# EAGLE design lithium-left-c (EAGLE 9.6.2)

## Sheet 1 of 2
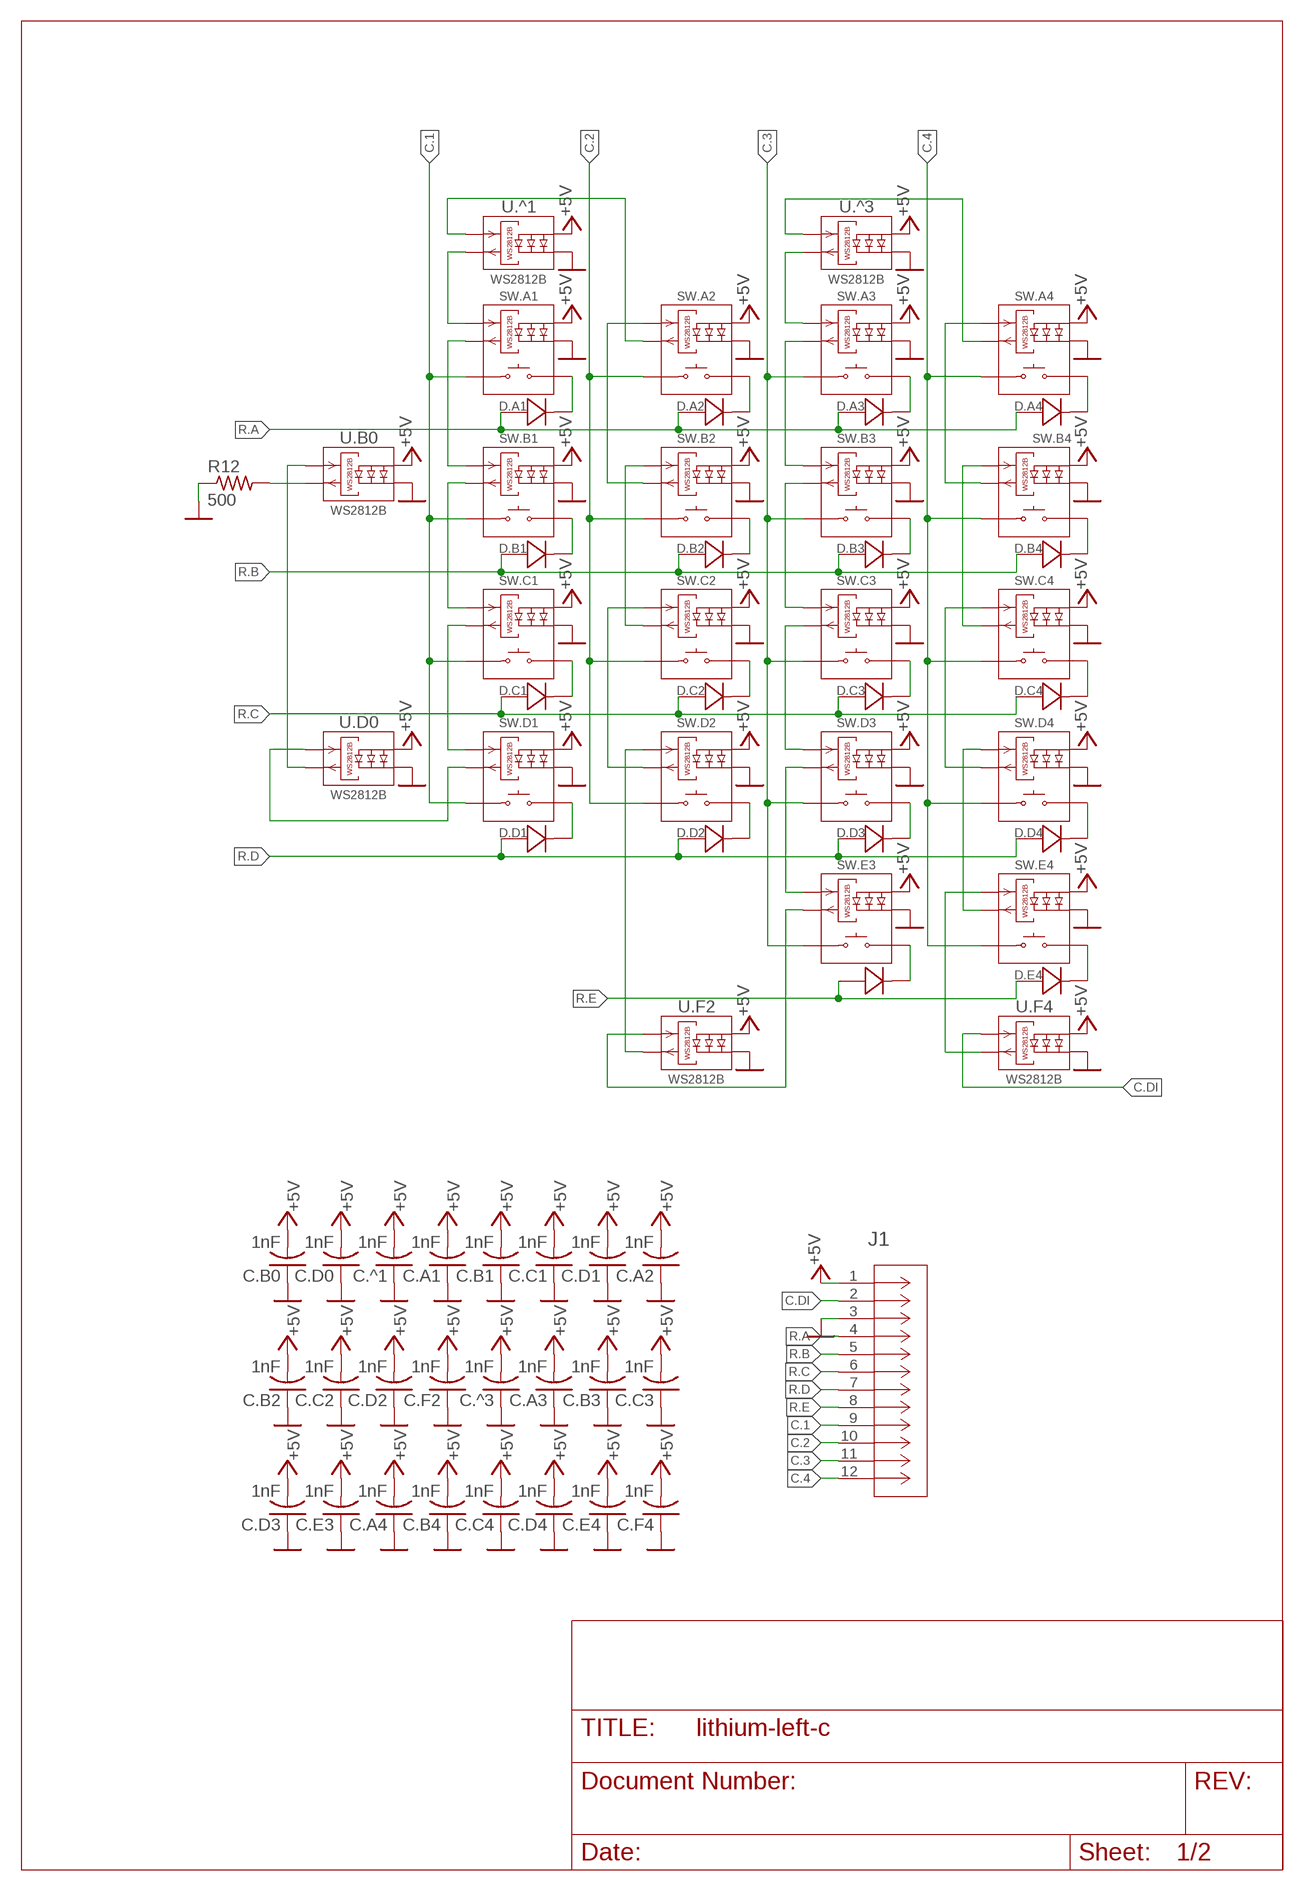
[diagram p0: schematic, sheet 1]

### Parts
C.^1  1nF  C-USC0805  [C0805]
C.^3  1nF  C-USC0805  [C0805]
C.A1  1nF  C-USC0805  [C0805]
C.A2  1nF  C-USC0805  [C0805]
C.A3  1nF  C-USC0805  [C0805]
C.A4  1nF  C-USC0805  [C0805]
C.B0  1nF  C-USC0805  [C0805]
C.B1  1nF  C-USC0805  [C0805]
C.B2  1nF  C-USC0805  [C0805]
C.B3  1nF  C-USC0805  [C0805]
C.B4  1nF  C-USC0805  [C0805]
C.C1  1nF  C-USC0805  [C0805]
C.C2  1nF  C-USC0805  [C0805]
C.C3  1nF  C-USC0805  [C0805]
C.C4  1nF  C-USC0805  [C0805]
C.D0  1nF  C-USC0805  [C0805]
C.D1  1nF  C-USC0805  [C0805]
C.D2  1nF  C-USC0805  [C0805]
C.D3  1nF  C-USC0805  [C0805]
C.D4  1nF  C-USC0805  [C0805]
C.E3  1nF  C-USC0805  [C0805]
C.E4  1nF  C-USC0805  [C0805]
C.F2  1nF  C-USC0805  [C0805]
C.F4  1nF  C-USC0805  [C0805]
D.A1  1N4148W  [CR_48W-E3-08_VIS]
D.A2  1N4148W  [CR_48W-E3-08_VIS]
D.A3  1N4148W  [CR_48W-E3-08_VIS]
D.A4  1N4148W  [CR_48W-E3-08_VIS]
D.B1  1N4148W  [CR_48W-E3-08_VIS]
D.B2  1N4148W  [CR_48W-E3-08_VIS]
D.B3  1N4148W  [CR_48W-E3-08_VIS]
D.B4  1N4148W  [CR_48W-E3-08_VIS]
D.C1  1N4148W  [CR_48W-E3-08_VIS]
D.C2  1N4148W  [CR_48W-E3-08_VIS]
D.C3  1N4148W  [CR_48W-E3-08_VIS]
D.C4  1N4148W  [CR_48W-E3-08_VIS]
D.D1  1N4148W  [CR_48W-E3-08_VIS]
D.D2  1N4148W  [CR_48W-E3-08_VIS]
D.D3  1N4148W  [CR_48W-E3-08_VIS]
D.D4  1N4148W  [CR_48W-E3-08_VIS]
D.E3  1N4148W  [CR_48W-E3-08_VIS]
D.E4  1N4148W  [CR_48W-E3-08_VIS]
J1  FFC2B28-12-G  [CONN_FFC2B28-12-G_GCT]
R12  500  R-US_R0805  [R0805]
SW.A1  PG1350_LEDSD  [PG1350_SD/SK68]
SW.A2  PG1350_LEDSD  [PG1350_SD/SK68]
SW.A3  PG1350_LEDSD  [PG1350_SD/SK68]
SW.A4  PG1350_LEDSD  [PG1350_SD/SK68]
SW.B1  PG1350_LEDSD  [PG1350_SD/SK68]
SW.B2  PG1350_LEDSD  [PG1350_SD/SK68]
SW.B3  PG1350_LEDSD  [PG1350_SD/SK68]
SW.B4  PG1350_LEDSD  [PG1350_SD/SK68]
SW.C1  PG1350_LEDSD  [PG1350_SD/SK68]
SW.C2  PG1350_LEDSD  [PG1350_SD/SK68]
SW.C3  PG1350_LEDSD  [PG1350_SD/SK68]
SW.C4  PG1350_LEDSD  [PG1350_SD/SK68]
SW.D1  PG1350_LEDSD  [PG1350_SD/SK68]
SW.D2  PG1350_LEDSD  [PG1350_SD/SK68]
SW.D3  PG1350_LEDSD  [PG1350_SD/SK68]
SW.D4  PG1350_LEDSD  [PG1350_SD/SK68]
SW.E3  PG1350_LEDSD  [PG1350_SD/SK68]
SW.E4  PG1350_LEDSD  [PG1350_SD/SK68]
U.^1  WS2812B  [SK68-R]
U.^3  WS2812B  [SK68-R]
U.B0  WS2812B  [SK68-R]
U.D0  WS2812B  [SK68-R]
U.F2  WS2812B  [SK68-R]
U.F4  WS2812B  [SK68-R]

### Nets
+5V [VCC]: C.^1.2 C.^3.2 C.A1.2 C.A2.2 C.A3.2 C.A4.2 C.B0.2 C.B1.2 C.B2.2 C.B3.2 C.B4.2 C.C1.2 C.C2.2 C.C3.2 C.C4.2 C.D0.2 C.D1.2 C.D2.2 C.D3.2 C.D4.2 C.E3.2 C.E4.2 C.F2.2 C.F4.2 J1.1 SW.A1.1-VDD(VDD) SW.A2.1-VDD(VDD) SW.A3.1-VDD(VDD) SW.A4.1-VDD(VDD) SW.B1.1-VDD(VDD) SW.B2.1-VDD(VDD) SW.B3.1-VDD(VDD) SW.B4.1-VDD(VDD) SW.C1.1-VDD(VDD) SW.C2.1-VDD(VDD) SW.C3.1-VDD(VDD) SW.C4.1-VDD(VDD) SW.D1.1-VDD(VDD) SW.D2.1-VDD(VDD) SW.D3.1-VDD(VDD) SW.D4.1-VDD(VDD) SW.E3.1-VDD(VDD) SW.E4.1-VDD(VDD) U.^1.1-VDD(VDD) U.^3.1-VDD(VDD) U.B0.1-VDD(VDD) U.D0.1-VDD(VDD) U.F2.1-VDD(VDD) U.F4.1-VDD(VDD)
C.1 [signal]: J1.9 SW.A1.1 SW.B1.1 SW.C1.1 SW.D1.1
C.2 [signal]: J1.10 SW.A2.1 SW.B2.1 SW.C2.1 SW.D2.1
C.3 [signal]: J1.11 SW.A3.1 SW.B3.1 SW.C3.1 SW.D3.1 SW.E3.1
C.4 [signal]: J1.12 SW.A4.1 SW.B4.1 SW.C4.1 SW.D4.1 SW.E4.1
C.DI [signal]: J1.2 U.F4.4-DIN(DI)
GND [signal]: C.^1.1 C.^3.1 C.A1.1 C.A2.1 C.A3.1 C.A4.1 C.B0.1 C.B1.1 C.B2.1 C.B3.1 C.B4.1 C.C1.1 C.C2.1 C.C3.1 C.C4.1 C.D0.1 C.D1.1 C.D2.1 C.D3.1 C.D4.1 C.E3.1 C.E4.1 C.F2.1 C.F4.1 J1.3 R12.1 SW.A1.3-GND(GND) SW.A2.3-GND(GND) SW.A3.3-GND(GND) SW.A4.3-GND(GND) SW.B1.3-GND(GND) SW.B2.3-GND(GND) SW.B3.3-GND(GND) SW.B4.3-GND(GND) SW.C1.3-GND(GND) SW.C2.3-GND(GND) SW.C3.3-GND(GND) SW.C4.3-GND(GND) SW.D1.3-GND(GND) SW.D2.3-GND(GND) SW.D3.3-GND(GND) SW.D4.3-GND(GND) SW.E3.3-GND(GND) SW.E4.3-GND(GND) U.^1.3-GND(GND) U.^3.3-GND(GND) U.B0.3-GND(GND) U.D0.3-GND(GND) U.F2.3-GND(GND) U.F4.3-GND(GND)
N$1 [signal]: D.A1.1 SW.A1.2
N$2 [signal]: D.B1.1 SW.B1.2
N$3 [signal]: D.C1.1 SW.C1.2
N$4 [signal]: D.B2.1 SW.B2.2
N$5 [signal]: D.D1.1 SW.D1.2
N$6 [signal]: D.A2.1 SW.A2.2
N$7 [signal]: D.C2.1 SW.C2.2
N$8 [signal]: D.D2.1 SW.D2.2
N$9 [signal]: D.B3.1 SW.B3.2
N$10 [signal]: D.C3.1 SW.C3.2
N$11 [signal]: D.A3.1 SW.A3.2
N$12 [signal]: D.D3.1 SW.D3.2
N$13 [signal]: D.B4.1 SW.B4.2
N$14 [signal]: D.E3.1 SW.E3.2
N$15 [signal]: D.C4.1 SW.C4.2
N$16 [signal]: D.A4.1 SW.A4.2
N$17 [signal]: D.D4.1 SW.D4.2
N$19 [signal]: D.E4.1 SW.E4.2
N$33 [signal]: SW.A2.2-DOUT(DO) U.^1.4-DIN(DI)
N$35 [signal]: SW.D1.2-DOUT(DO) U.D0.4-DIN(DI)
N$36 [signal]: SW.A2.4-DIN(DI) SW.B2.2-DOUT(DO)
N$37 [signal]: SW.B2.4-DIN(DI) SW.C2.2-DOUT(DO)
N$40 [signal]: SW.A1.4-DIN(DI) U.^1.2-DOUT(DO)
N$41 [signal]: SW.A1.2-DOUT(DO) SW.B1.4-DIN(DI)
N$42 [signal]: SW.B1.2-DOUT(DO) SW.C1.4-DIN(DI)
N$43 [signal]: SW.C1.2-DOUT(DO) SW.D1.4-DIN(DI)
N$44 [signal]: R12.2 U.B0.2-DOUT(DO)
N$46 [signal]: SW.D3.2-DOUT(DO) SW.E3.4-DIN(DI)
N$47 [signal]: SW.C3.2-DOUT(DO) SW.D3.4-DIN(DI)
N$48 [signal]: SW.B3.2-DOUT(DO) SW.C3.4-DIN(DI)
N$49 [signal]: SW.A3.2-DOUT(DO) SW.B3.4-DIN(DI)
N$50 [signal]: SW.A3.4-DIN(DI) U.^3.2-DOUT(DO)
N$51 [signal]: SW.E3.2-DOUT(DO) U.F2.4-DIN(DI)
N$52 [signal]: U.B0.4-DIN(DI) U.D0.2-DOUT(DO)
N$53 [signal]: SW.C4.4-DIN(DI) SW.D4.2-DOUT(DO)
N$54 [signal]: SW.B4.4-DIN(DI) SW.C4.2-DOUT(DO)
N$55 [signal]: SW.A4.4-DIN(DI) SW.B4.2-DOUT(DO)
N$56 [signal]: SW.C2.4-DIN(DI) SW.D2.2-DOUT(DO)
N$64 [signal]: SW.A4.2-DOUT(DO) U.^3.4-DIN(DI)
N$73 [signal]: SW.D4.4-DIN(DI) SW.E4.2-DOUT(DO)
N$74 [signal]: SW.D2.4-DIN(DI) U.F2.2-DOUT(DO)
N$89 [signal]: SW.E4.4-DIN(DI) U.F4.2-DOUT(DO)
R.A [signal]: D.A1.2 D.A2.2 D.A3.2 D.A4.2 J1.4
R.B [signal]: D.B1.2 D.B2.2 D.B3.2 D.B4.2 J1.5
R.C [signal]: D.C1.2 D.C2.2 D.C3.2 D.C4.2 J1.6
R.D [signal]: D.D1.2 D.D2.2 D.D3.2 D.D4.2 J1.7
R.E [signal]: D.E3.2 D.E4.2 J1.8

## Sheet 2 of 2
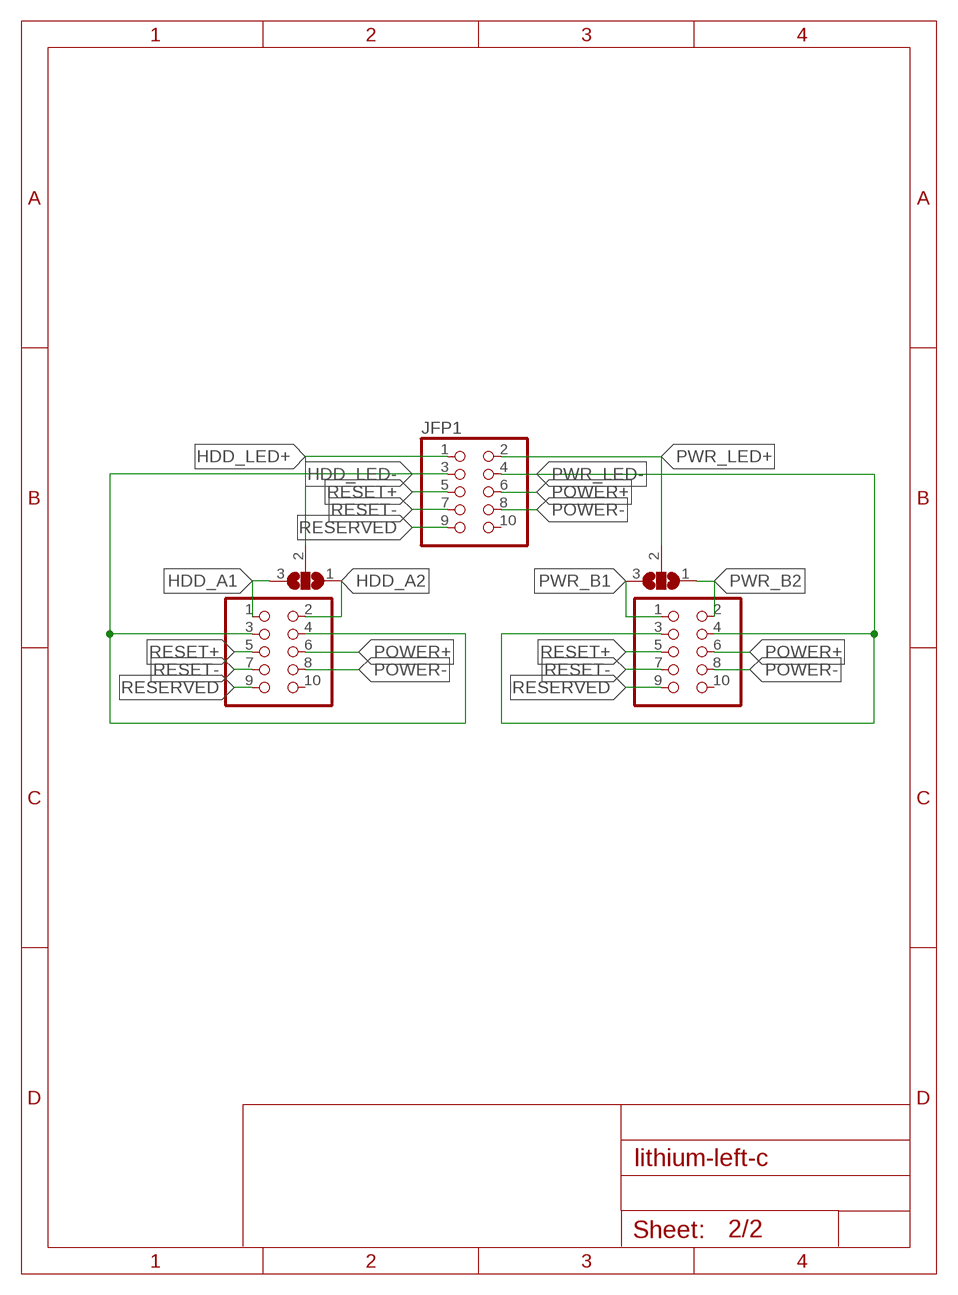
[diagram p1: schematic, sheet 2]

### Parts
HDD_LED  PINHD-2X5  [2X05]
J_HDD  SJ2W  [SJ_2]
J_PWR  SJ2W  [SJ_2]
JFP1  PINHD-2X5  [2X05]
PWR_LED  PINHD-2X5  [2X05]

### Nets
HDD_A1 [VCC]: HDD_LED.1 J_HDD.3
HDD_A2 [VCC]: HDD_LED.2 J_HDD.1
HDD_LED+ [VCC]: J_HDD.2 JFP1.1
HDD_LED- [VCC]: HDD_LED.3 HDD_LED.4 JFP1.3
POWER+ [VCC]: HDD_LED.6 JFP1.6 PWR_LED.6
POWER- [VCC]: HDD_LED.8 JFP1.8 PWR_LED.8
PWR_B1 [VCC]: J_PWR.3 PWR_LED.1
PWR_B2 [VCC]: J_PWR.1 PWR_LED.2
PWR_LED+ [VCC]: J_PWR.2 JFP1.2
PWR_LED- [VCC]: JFP1.4 PWR_LED.3 PWR_LED.4
RESERVED [VCC]: HDD_LED.9 JFP1.9 PWR_LED.9
RESET+ [VCC]: HDD_LED.5 JFP1.5 PWR_LED.5
RESET- [VCC]: HDD_LED.7 JFP1.7 PWR_LED.7
Unconnected: HDD_LED.10 JFP1.10 PWR_LED.10

## Library data of the parts
C.^1 C.^3 C.A1-C.A4 C.B0 C.B1-C.B4 C.C1-C.C4 C.D0 C.D1-C.D4 C.E3 C.E4 C.F2 C.F4 = adafruit:C-US: CAPACITOR, American symbol
D.A1-D.A4 D.B1-D.B4 D.C1-D.C4 D.D1-D.D4 D.E3 D.E4 = lithium:1N4148W
HDD_LED JFP1 PWR_LED = pinhead:PINHD-2X5: PIN HEADER
J1 = lithium:FFC2B28-12-G
J_HDD J_PWR = jumper:SJ2W: SMD solder JUMPER
R12 = adafruit:R-US_: RESISTOR, American symbol
SW.A1-SW.A4 SW.B1-SW.B4 SW.C1-SW.C4 SW.D1-SW.D4 SW.E3 SW.E4 = lithium:PG1350_LED
U.^1 U.^3 U.B0 U.D0 U.F2 U.F4 = lithium:WS2812B

## Net classes
1 VCC: width 0.6 mm, drill 0.508 mm, clearance 0.3 mm
2 GND: width 0.5 mm, drill 0.4 mm, clearance 0.6 mm to class 1, clearance 0.3 mm
3 data: width 0.4 mm, drill 0.3 mm, clearance 0.6 mm to class 1, clearance 0.5 mm to class 2, clearance 0.6 mm
4 signal: width 0.4 mm, drill 0.29 mm, clearance 0.5 mm to class 1, clearance 0.5 mm to class 2, clearance 0.5 mm to class 3, clearance 0.3 mm

## Board
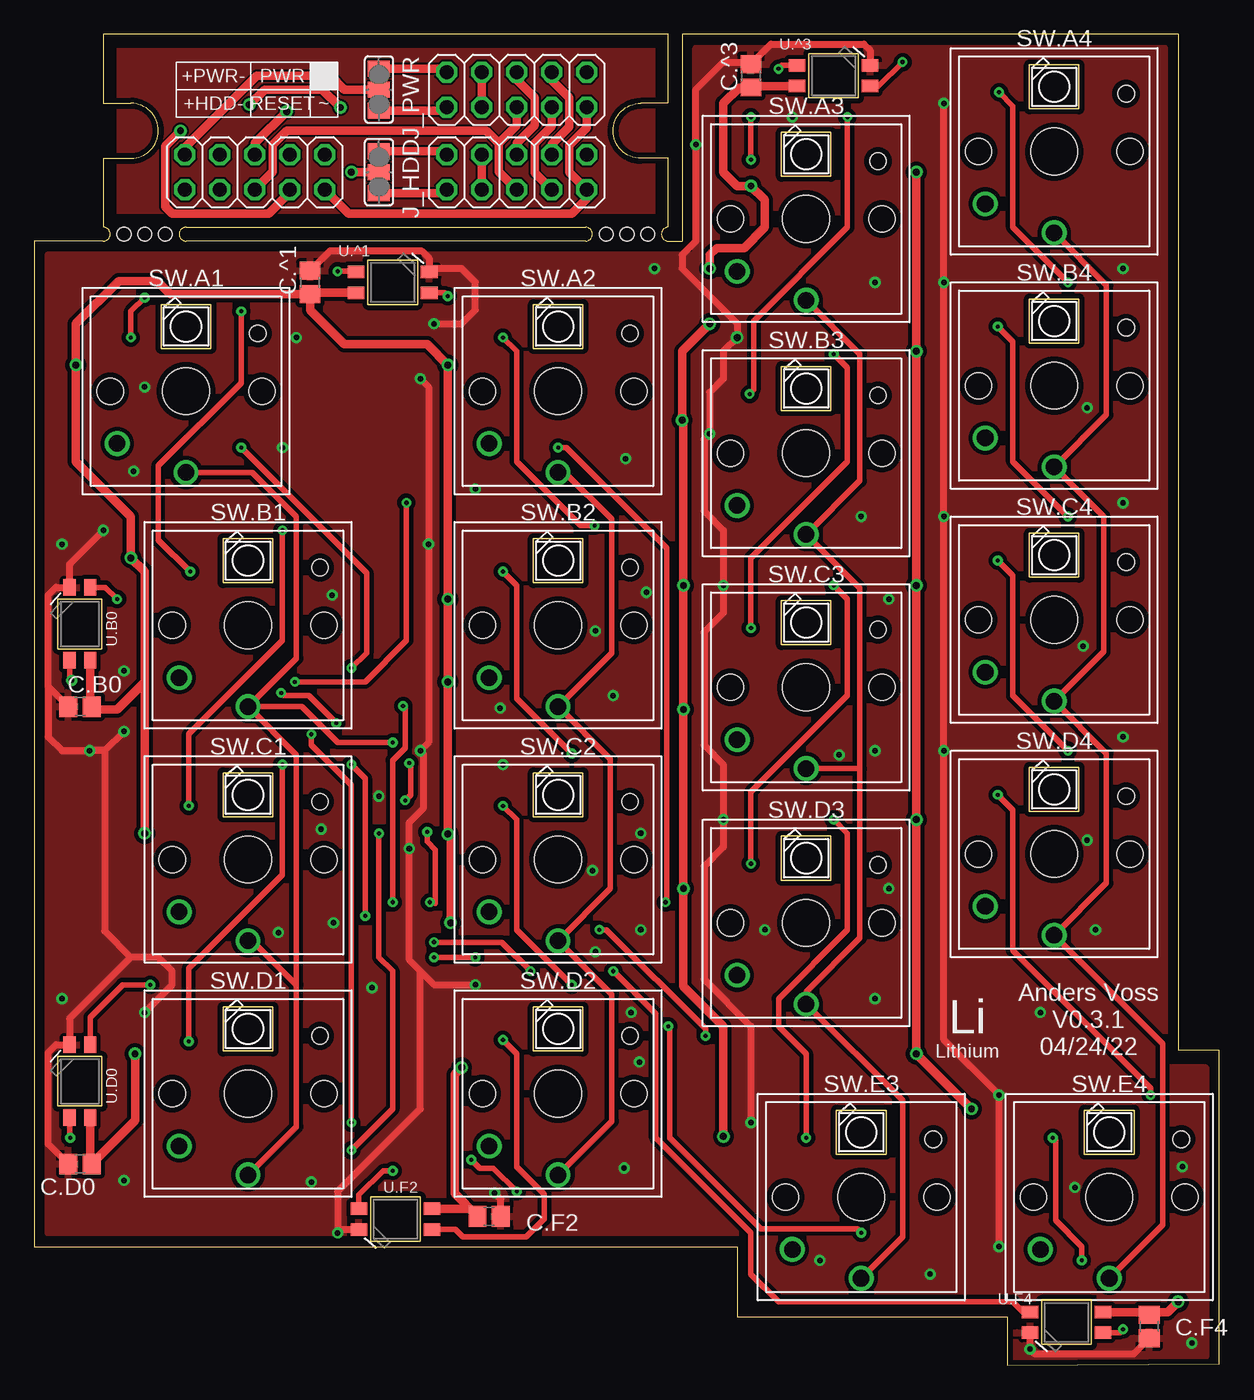
[diagram p2: board, top side]
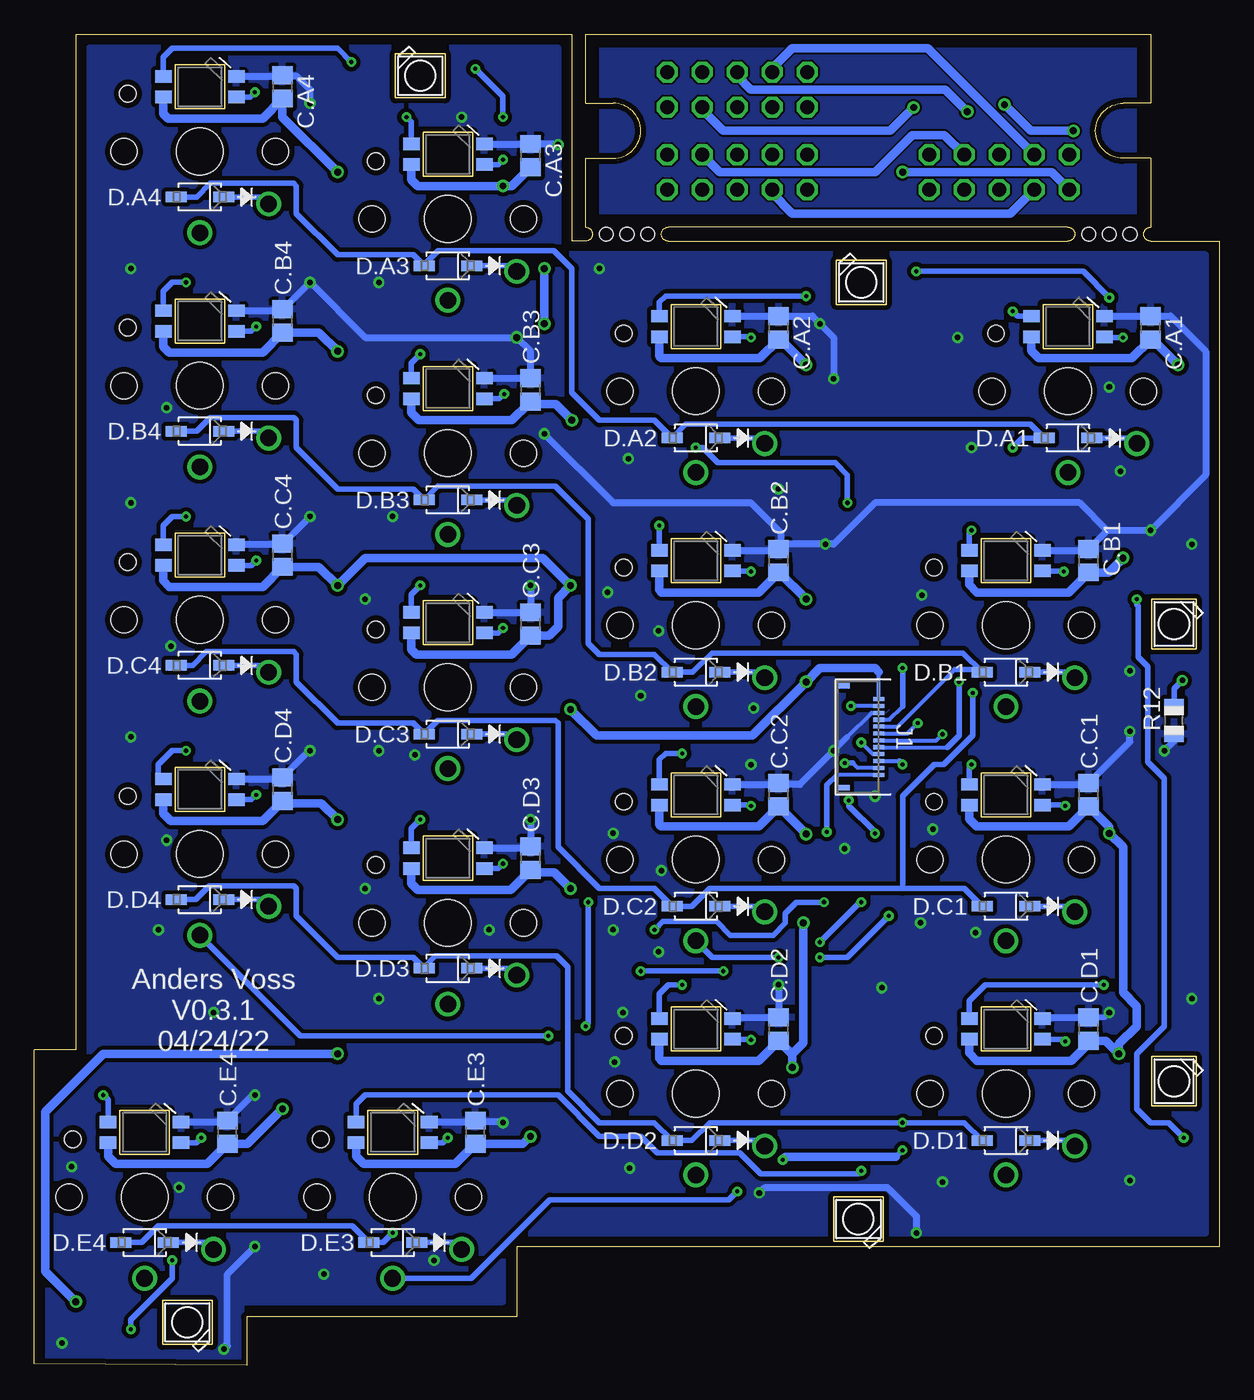
[diagram p3: board, bottom side, seen from below]

Size 86 x 96.6 mm. Coordinates in mm from the lower left corner, seen from the top.
Outline: 83,96.6 47,96.6 47,81.6 46,81.6 arc-180 46,82.6 46,87.6 44,87.6 arc-180 44,91.6 46,91.6 46,96.6 5,96.6 5,91.6 7,91.6 arc-180 7,87.6 5,87.6 5,82.6 arc-180 5,81.6 0,81.6 0,8.6 51,8.6 51,3.5 70.6,3.5 70.6,0 86,0.1 86,22.9 83,22.9 83,96.6
Outline: 11,82.6 arc180 11,81.6 40,81.6 arc180 40,82.6 11,82.6
Copper layers (1*16): Top 0.035mm / dielectric 1.5mm / Bottom 0.035mm
Design rules "default *": minimum track width 6mil, minimum drill 0.35mm, track to track 6mil, track to pad 6mil, pad to pad 6mil, via to via 6mil, smd to smd 6mil, copper to edge 16mil, drill to drill 6mil, minimum pad ring 10mil, minimum via ring 8mil, stop-mask expansion 4mil, vias tented up to drill 30mil, thermal gap 10mil
Holes 1 mm at 6.5,82.1 8,82.1 9.5,82.1 41.5,82.1 43,82.1 44.5,82.1

### Footprints (pad centres in the part's own frame; a part is rotated, then mirrored left to right if it is on the bottom)
C0805 = smd 1.3 x 1.5: 1 -0.85,0; 2 0.85,0
CR_48W-E3-08_VIS = smd 1.524 x 0.762: 1 -1.727,0; 2 1.727,0
2X05 = drill 1.016 octagon: 1 -5.08,-1.27; 2 -5.08,1.27; 3 -2.54,-1.27; 4 -2.54,1.27; 5 0,-1.27; 6 0,1.27; 7 2.54,-1.27; 8 2.54,1.27; 9 5.08,-1.27; 10 5.08,1.27
CONN_FFC2B28-12-G_GCT = smd 0.3 x 0.8: 1 -2.75,1.27; 2 -2.25,1.27; 3 -1.75,1.27; 4 -1.25,1.27; 5 -0.75,1.27; 6 -0.25,1.27; 7 0.25,1.27; 8 0.75,1.27; 9 1.25,1.27; 10 1.75,1.27; 11 2.25,1.27; 12 2.75,1.27 | smd 0.4 x 0.8: 13 3.7,-1.23; 14 -3.7,-1.23
SJ_2 = smd 1.168 x 1.6: 1 -1.524,0; 2 0,0; 3 1.524,0
R0805 = smd 1.1 x 1.4: 1 -1,0; 2 1,0
PG1350_SD/SK68 = drill 1.2: 1 0,-5.9; 2 -5,-3.8 | smd 1.2 x 0.9 bottom: 1-VDD 2.65,3.949; 2-DOUT 2.65,5.449; 3-GND -2.65,5.449; 4-DIN -2.65,3.949 | hole 3.4: 0,0 | hole 1.9: -5.5,0; 5.5,0 | hole 1.2: 5.22,4.2
SK68-R = smd 1.2 x 0.9 bottom: 1-VDD 2.65,-0.75; 2-DOUT 2.65,0.75; 3-GND -2.65,0.75; 4-DIN -2.65,-0.75

### Placement (x,y rotation side)
C.^1  20,78.6 270 top
C.^3  52,93.6 270 top
C.A1  5,75.3 270 bottom
C.A2  32,75.3 270 bottom
C.A3  50,87.8 270 bottom
C.A4  68,92.8 270 bottom
C.B0  3.3,47.8 0 top
C.B1  9.5,58.4 270 bottom
C.B2  32,58.4 270 bottom
C.B3  50,70.8 270 bottom
C.B4  68,75.8 270 bottom
C.C1  9.5,41.4 270 bottom
C.C2  32,41.4 270 bottom
C.C3  50,53.8 270 bottom
C.C4  68,58.8 270 bottom
C.D0  3.3,14.6 0 top
C.D1  9.5,24.4 270 bottom
C.D2  32,24.4 270 bottom
C.D3  50,36.8 270 bottom
C.D4  68,41.8 270 bottom
C.E3  54,16.9 270 bottom
C.E4  72,16.9 270 bottom
C.F2  33,10.8 180 top
C.F4  80.9,2.8 90 top
D.A1  11,67.3 180 bottom
D.A2  38,67.3 180 bottom
D.A3  56,79.8 180 bottom
D.A4  74,84.8 180 bottom
D.B1  15.5,50.3 180 bottom
D.B2  38,50.3 180 bottom
D.B3  56,62.8 180 bottom
D.B4  74,67.8 180 bottom
D.C1  15.5,33.3 180 bottom
D.C2  38,33.3 180 bottom
D.C3  56,45.8 180 bottom
D.C4  74,50.8 180 bottom
D.D1  15.5,16.3 180 bottom
D.D2  38,16.3 180 bottom
D.D3  56,28.8 180 bottom
D.D4  74,33.8 180 bottom
D.E3  60,8.9 180 bottom
D.E4  78,8.9 180 bottom
HDD_LED  35,86.6 0 top
J1  26,45.6 270 bottom
J_HDD  25,86.6 270 top
J_PWR  25,92.6 270 top
JFP1  16,86.6 0 top
PWR_LED  35,92.6 0 top
R12  3.3,46.8 90 bottom
SW.A1  11,70.7 0 top
SW.A2  38,70.7 0 top
SW.A3  56,83.2 0 top
SW.A4  74,88.1 0 top
SW.B1  15.5,53.7 0 top
SW.B2  38,53.7 0 top
SW.B3  56,66.2 0 top
SW.B4  74,71.1 0 top
SW.C1  15.5,36.7 0 top
SW.C2  38,36.7 0 top
SW.C3  56,49.2 0 top
SW.C4  74,54.1 0 top
SW.D1  15.5,19.7 0 top
SW.D2  38,19.7 0 top
SW.D3  56,32.1 0 top
SW.D4  74,37.1 0 top
SW.E3  60,12.2 0 top
SW.E4  78,12.2 0 top
U.^1  26,78.6 0 bottom
U.^3  58,93.6 0 bottom
U.B0  3.3,53.8 270 bottom
U.D0  3.3,20.6 270 bottom
U.F2  26.2,10.6 180 bottom
U.F4  74.9,3.1 180 bottom

### Tracks (layer width: path | path; a pad name or v marks a point on that pad's centre or on a via)
+5V  (via drill 0.5)
  Top 0.6: U.B0.1-VDD 4.05,47.9 C.B0.2 4.35,47.6 6,47.6 8,49.6 | C.^1.2 20.1,77.85 U.^1.1-VDD | U.D0.1-VDD 4.05,14.7 C.D0.2 7.3,17.75 v7.3,22.6 | U.F2.1-VDD 31.6,11.35 C.F2.2 30.5,12.45 30.5,21.1 v31,21.6 | U.F4.1-VDD 80.7,3.85 | 80.7,3.85 C.F4.2 | U.^3.1-VDD 52.1,92.85 C.^3.2 51.15,92.75 50,91.6 50,86.6 51,85.6 v52,85.6 53,84.6 53,82.6 51.5,81.1 49.5,81.1 49,80.6 v49,79.6 | v30.2,32.1 30.2,38.35 v30,38.55 v30,49.6 v30,55.6 v30,72.6 28.5,74.1 22.5,74.1 20,76.6 C.^1.2 | C.^1.2 9.85,77.75 8.9,78.7 6.1,78.7 3,75.6 v3,72.6 3,65.6 7,61.6 v7,58.6 8,57.6 8,49.6 | 8,49.6 v8,38.6 | v64,86.6 v64,73.6 v64,56.6 v64,39.6 v64,22.6 v68,18.6 | v50,16.6 50,24.6 47.1,27.5 v47.1,34.6 v47.1,47.6 v47.1,56.6 47.1,68.5 v47,68.6 47,73.6 v49,75.6 | v83,4.6 82.25,3.85 80.7,3.85
  Bottom 0.3: J1.1 24.73,50.33
  Bottom 0.6: SW.B1.1-VDD 18.15,56.65 17.6,56.1 10.95,56.1 C.B1.2 8.05,57.55 v7,58.6 | SW.A1.1-VDD 13.65,73.65 13.1,73.1 6.35,73.1 C.A1.2 4.85,74.45 v3,72.6 | SW.C1.1-VDD 18.15,39.65 17.6,39.1 10.95,39.1 C.C1.2 8,39.05 v8,38.6 7,37.6 7,27.05 6,26.05 6,24.6 7.3,23.3 v7.3,22.6 8.25,23.55 C.D1.2 9.5,23.35 10.75,22.1 17.6,22.1 18.15,22.65 SW.D1.1-VDD | SW.D2.1-VDD 40.65,22.25 40.5,22.1 33.45,22.1 C.D2.2 31,22.55 v31,21.6 31,22.6 30.2,23.4 v30.2,32.1 | SW.C2.1-VDD 40.65,39.25 40.5,39.1 33.45,39.1 C.C2.2 v30,38.55 | SW.B2.1-VDD 40.65,56.25 40.5,56.1 33.45,56.1 C.B2.2 31.95,57.55 v30,55.6 | SW.A2.1-VDD 40.65,73.25 40.5,73.1 33.35,73.1 C.A2.2 31.85,74.45 v30,72.6 | SW.A3.1-VDD 58.65,86.05 58.2,85.6 v52,85.6 51.35,85.6 C.A3.2 | C.B3.2 50.17,69.77 | 50.17,69.77 51.35,68.6 58.1,68.6 58.65,69.15 SW.B3.1-VDD | SW.C3.1-VDD 58.65,51.95 58.3,51.6 51.35,51.6 C.C3.2 48.65,52.95 48,53.6 48,55.7 v47.1,56.6 49.1,58.6 62,58.6 v64,56.6 65.35,57.95 C.C4.2 69.45,56.5 76.2,56.5 76.65,56.95 SW.C4.1-VDD | C.D3.2 50.17,35.77 | 50.17,35.77 51.45,34.5 58.2,34.5 58.65,34.95 SW.D3.1-VDD | SW.E3.1-VDD 62.65,15.15 62.1,14.6 55.45,14.6 C.E3.2 50.55,16.05 v50,16.6 | SW.E4.1-VDD 80.65,15.15 80.1,14.6 73.45,14.6 C.E4.2 70.55,16.05 v68,18.6 | C.D4.2 68.17,40.77 | 68.17,40.77 69.45,39.5 76.1,39.5 76.65,40.05 SW.D4.1-VDD | SW.B4.1-VDD 76.65,73.95 76.2,73.5 69.45,73.5 C.B4.2 65.35,74.95 v64,73.6 | SW.A4.1-VDD 76.65,90.85 76.3,90.5 69.45,90.5 C.A4.2 68,90.6 v64,86.6 | v64,39.6 65.17,40.77 68.17,40.77 | v47.1,34.6 48.27,35.77 50.17,35.77 | v47,68.6 48.17,69.77 50.17,69.77 | v49,75.6 v49,79.6 | v47.1,47.6 45.2,45.7 33.9,45.7 v30,49.6 29,50.6 25,50.6 24.73,50.33
  Bottom 0.6: v64,22.6 81,22.6 85.2,18.4 85.2,6.8 v83,4.6
C.1  (via drill 0.3)
  Top 0.4: SW.B1.1 19,51.3 19,61.6 15.8,64.8 SW.A1.1 | SW.C1.1 15.65,30.95 19,27.6 | SW.B1.1 19,44.3 19,27.6 | SW.D1.1 19,17.3 19,27.6 | v26,45.2 22,45.2 19.4,47.8 SW.B1.1
  Bottom 0.3: J1.9 25.15,44.35 v26,45.2
C.2  (via drill 0.3)
  Top 0.4: SW.D2.1 41.9,17.7 41.9,26.9 SW.C2.1 41.8,34.6 41.8,44 SW.B2.1 41.9,51.7 41.9,61.4 38.5,64.8 SW.A2.1 | v32,29.6 v29,29.6 | v23,43.6 24,42.6 v24,32.6
  Bottom 0.3: J1.10 23.25,43.85
  Bottom 0.4: SW.C2.1 36.8,29.6 v32,29.6 | v29,29.6 27,29.6 v24,32.6 | 23.25,43.85 v23,43.6
C.3  (via drill 0.3)
  Top 0.4: SW.E3.1 63,9.3 63,19.2 SW.D3.1 56,27.1 59.9,31 59.9,43.3 | SW.C3.1 59.9,43.3 | 59.9,43.3 59.9,56.4 SW.B3.1 59.9,64.2 59.9,73.4 SW.A3.1 | v35,12.6 33.3,14.3 32.3,14.3 v31.7,14.9 | v27.2,43.7 27.3,43.6 27.3,41.4 v26.9,41 | v25,38.6 25,29.6 26,28.6 26,18.6 v23,15.6
  Bottom 0.3: J1.11 26.25,43.35 26.6,43.7
  Bottom 0.4: SW.E3.1 54.3,6.3 48.6,12 35.6,12 v35,12.6 | v31.7,14.9 31.5,15.1 | 23.5,15.1 v23,15.6 | 26.6,43.7 v27.2,43.7 | v25,38.6 25,38.7 26.9,40.6 v26.9,41
  Bottom 0.6: 31.5,15.1 23.5,15.1
C.4  (via drill 0.3)
  Top 0.4: SW.A4.1 77.8,78.4 77.8,69 SW.B4.1 77.6,61.6 77.6,51.8 SW.C4.1 77.8,44.4 77.8,35 SW.D4.1 81.9,23.3 81.9,10.2 SW.E4.1 | v48.7,23.9 48.7,24.4 41.5,31.6 v41,31.6 | v28.5,38.7 28.5,38 29.1,37.4 29.1,33.5 29,33.6 v28.7,33.6
  Bottom 0.3: J1.12 27.75,42.85
  Bottom 0.4: SW.D4.1 66.7,23.9 v48.7,23.9 | v28.5,38.7 28.5,42.1 27.75,42.85 | v28.7,33.6 30.7,33.6 31.5,32.8 31.5,32.1 32.4,31.2 35.5,31.2 36.5,32.2 40.4,32.2 v41,31.6
C.DI  (via drill 0.3)
  Top 0.4: U.F4.4-DIN 71.75,3.85 71,4.6 54,4.6 52,6.6 52,9.6 45.1,16.5 45.1,25.5 v42,28.6 | v36,28.6 33.9,30.7 v29,30.7 | v26.75,47.85 26.9,47.7 26.9,44.8 26,43.9 v26,33.6
  Bottom 0.3: J1.2 v26.75,47.85
  Bottom 0.4: v42,28.6 v36,28.6 | v29,30.7 26.1,33.6 v26,33.6
GND  (via drill 0.4, 0.5)
  Top 0.5: U.^3.3-GND 60.65,95.45 60.2,95.9 53.45,95.9 C.^3.1 51.85,94.6 50,94.6 48,92.6 v48,88.6 48,81.6 47,80.6 47,79.6 51,75.6 v51,74.6 50,73.6 50,71.6 49,70.6 v49,67.6 48.6,67.2 48.6,62 50,60.6 v50,56.6 50,54.6 48.6,53.2 48.6,45 50,43.6 v50,39.6 50,37.6 48.6,36.2 48.6,28 52,24.6 v52,17.6 | C.^1.1 21.45,80.9 28.1,80.9 28.65,80.35 U.^1.3-GND 28.9,79.6 31,79.6 32,78.6 32,76.6 31,75.6 v29,75.6 | C.B0.1 1,49.25 | 1,49.25 1,55.9 1.55,56.45 U.B0.3-GND 2.55,58.15 v5,60.6 | C.D0.1 1,16.05 1,22.7 1.55,23.25 U.D0.3-GND 2.55,25.15 7,29.6 | C.F2.1 33.85,12.05 v33.4,12.5 | U.F2.3-GND 22.25,9.85 v22,9.6 22,12.6 28,18.6 28,28.6 | C.F4.1 79.75,0.8 72.6,0.8 v72.25,1.15 U.F4.3-GND | v6.5,46 5.1,44.6 | 5.1,44.6 v4,44.6 2,44.6 1,45.6 1,49.25 | v28,71.6 28.6,71 v28.6,59.6 28.6,45.2 v28,44.6 28.2,44.4 28.2,40.4 27.2,39.4 27.2,29.4 28,28.6 | 28,28.6 29,27.6 v32,27.6 | v70,8.6 v70,19.6 66,23.6 v66,44.6 v66,61.6 v66,78.6 v66,91.6 | v8,25.6 10,27.6 10,28.6 9,29.6 7,29.6 | 5.1,44.6 5.1,31.5 7,29.6
  Bottom 0.3: 27,45.6 25.25,47.35 J1.3
  Bottom 0.4: v28,44.6 27,45.6 | C.D1.1 8.35,25.25 v8,25.6
  Bottom 0.5: SW.A4.3-GND 68.1,93.55 | 68.1,93.55 C.A4.1 | SW.B4.3-GND 68.1,76.55 C.B4.1 67.95,76.65 v66,78.6 62,74.6 v51,74.6 50,73.6 C.B3.1 | SW.D4.3-GND 68.1,42.55 C.D4.1 66.05,44.6 v66,44.6 | SW.E4.3-GND 72.1,17.65 C.E4.1 70.15,19.6 v70,19.6 | SW.E3.3-GND 54.1,17.65 | 54.1,17.65 C.E3.1 | SW.D3.3-GND 50.1,37.55 C.D3.1 v50,39.6 | SW.C3.3-GND C.C3.1 v50,56.6 | SW.B3.3-GND C.B3.1 | C.B3.1 | SW.A3.3-GND C.A3.1 48.05,88.65 v48,88.6 | SW.A2.3-GND C.A2.1 29.55,76.15 v29,75.6 28,74.6 v28,71.6 | SW.B2.3-GND 32.1,59.15 C.B2.1 31.83,59.42 | SW.C2.3-GND 32.1,42.15 | 32.1,42.15 C.C2.1 | SW.D2.3-GND 35.25,25.25 C.D2.1 v32,27.6 | SW.D1.3-GND 12.75,25.25 C.D1.1 | SW.C1.3-GND 9.6,42.15 C.C1.1 6.5,45.25 v6.5,46 | SW.B1.3-GND 9.6,59.15 C.B1.1 8.15,60.6 | SW.A1.3-GND C.A1.1 3.55,76.15 1,73.6 1,64.6 v5,60.6 8.15,60.6 | v33.4,12.5 33,12.9 24.1,12.9 22,10.8 v22,9.6 | SW.C4.3-GND 68.1,59.55 C.C4.1 67.95,59.65 v66,61.6 | v4,44.6 3.3,45.3 R12.1 | 31.83,59.42 31.65,59.6 v28.6,59.6 28,59.6 25,62.6 10.15,62.6 8.15,60.6 | v28,44.6 30.45,42.15 32.1,42.15 | v52,17.6 52.05,17.65 54.1,17.65 | v72.25,1.15 72,1.4 72,6.6 v70,8.6 | v66,91.6 66,92.6 66.95,93.55 68.1,93.55 | v49,67.6 44,62.6 34,62.6 31.83,60.42 31.83,59.42
  other vias: 42.8,14.3 43.9,22 43.3,25.6 44,31.6 42,48.6 44.4,56.1 42.9,65.8 45,79.6 21.6,55.9 2,59.6 21.7,32.1 20.1,13.3 6.5,13.4 2,26.6 6.5,50.4 7.2,64.9 8,71 19,74.6 32,63.6 40.7,53.3 34,43.6 33.8,47.7 57,7.6 83.3,14.4 65,6.6 84,1.6 73,25.6 61,26.6 62,34.6 61,44.6 77,31.6 79,45.6 76.4,38.1 76.1,52.2 79,62.6 76.4,69.5 60,61.6 62,55.6 61,78.6 55,90.6 79,79.6 18,66.6 40.7,30 20.8,38.9 24.5,27.4 27.2,37.5 44,38.6 53,31.6 40.5,35.9 75.5,12.9 25,41.3 17.7,31.4 58.4,44.3
  pour Top: 1,80.6 48,80.6 48,95.6 82,95.6 82,21.6 84,21.6 85,21.6 85,0.6 71,0.6 71,4.6 52,4.6 52,9.6 1,9.6
  pour Bottom: 1,80.6 48,80.6 48,95.6 82,95.6 82,21.6 84,21.6 85,21.6 85,0.6 71,0.6 71,4.6 52,4.6 52,9.6 1,9.6
HDD_A1
  Top 0.6: J_HDD.3 29.67,85.08 HDD_LED.1
HDD_A2
  Top 0.6: J_HDD.1 29.67,88.12 HDD_LED.2
HDD_LED+  (via drill 0.5)
  Top 0.6: v23,86.6 J_HDD.2
  Bottom 0.6: JFP1.1 12.19,86.6 v23,86.6
HDD_LED-
  Top 0.6: HDD_LED.4 HDD_LED.3
  Bottom 0.6: JFP1.3 15.19,83.6 31,83.6 32.46,85.06 HDD_LED.3
INF1
  pour Bottom: 6,95.6 45,95.6 45,83.6 6,83.6
INF2
  pour Top: 6,95.6 45,95.6 45,83.6 6,83.6
N$1
  Bottom 0.4: D.A1.1 6.4,67.3 SW.A1.2
N$2
  Bottom 0.4: D.B1.1 10.9,50.3 SW.B1.2
N$3
  Bottom 0.4: D.C1.1 10.9,33.3 SW.C1.2
N$4
  Bottom 0.4: D.B2.1 33.4,50.3 SW.B2.2
N$5
  Bottom 0.4: D.D1.1 10.9,16.3 SW.D1.2
N$6
  Bottom 0.4: D.A2.1 33.4,67.3 SW.A2.2
N$7
  Bottom 0.4: D.C2.1 33.4,33.3 SW.C2.2
N$8
  Bottom 0.4: D.D2.1 33.4,16.3 SW.D2.2
N$9
  Bottom 0.4: D.B3.1 51.4,62.8 SW.B3.2
N$10
  Bottom 0.4: D.C3.1 51.4,45.8 SW.C3.2
N$11
  Bottom 0.4: D.A3.1 51.4,79.8 SW.A3.2
N$12
  Bottom 0.4: D.D3.1 51.5,28.8 SW.D3.2
N$13
  Bottom 0.4: D.B4.1 69.5,67.8 SW.B4.2
N$14
  Bottom 0.4: D.E3.1 55.5,8.9 SW.E3.2
N$15
  Bottom 0.4: D.C4.1 69.5,50.8 SW.C4.2
N$16
  Bottom 0.4: D.A4.1 69.5,84.8 SW.A4.2
N$17
  Bottom 0.4: D.D4.1 69.5,33.8 SW.D4.2
N$19
  Bottom 0.4: D.E4.1 73.5,8.9 SW.E4.2
N$33  (via drill 0.3)
  Top 0.4: U.^1.4-DIN 29.75,77.85 v30,77.6
  Bottom 0.4: v30,77.6 40.2,77.6 40.65,77.15 SW.A2.2-DOUT
N$35  (via drill 0.3)
  Top 0.4: v8.4,27.6 6.4,27.6 4.05,25.25 U.D0.4-DIN
  Bottom 0.4: SW.D1.2-DOUT 18.15,26.45 17,27.6 v8.4,27.6
N$36  (via drill 0.3)
  Top 0.4: v34,74.6 35,73.6 35,65.6 39.65,60.95 v40.65,60.95
  Bottom 0.4: SW.A2.4-DIN 34.05,74.65 v34,74.6 | SW.B2.2-DOUT v40.65,60.95
N$37  (via drill 0.3)
  Top 0.4: v39,44.4 35,48.4 35,56.6 v34,57.6
  Bottom 0.4: SW.C2.2-DOUT 40.65,43.95 40.2,44.4 v39,44.4 | v34,57.6 34.05,57.65 SW.B2.4-DIN
N$40  (via drill 0.3)
  Top 0.4: v7,74.6 7,76.5 v8,77.5 | v22,79.4 23.3,79.4 U.^1.2-DOUT
  Bottom 0.4: SW.A1.4-DIN 8.3,74.6 v7,74.6 | v8,77.5 9.9,79.4 v22,79.4
N$41  (via drill 0.3)
  Top 0.4: v11.3,57.6 9,59.9 9,65.3 15,71.3 v15,76.5
  Bottom 0.4: SW.B1.4-DIN 11.35,57.65 v11.3,57.6 | v15,76.5 14.65,76.15 SW.A1.2-DOUT
N$42  (via drill 0.3)
  Top 0.4: v11.2,40.6 11.2,45.8 18,52.6 v18,60.6
  Bottom 0.4: SW.C1.4-DIN 11.25,40.65 v11.2,40.6 | v18,60.6 18.15,60.45 SW.B1.2-DOUT
N$43  (via drill 0.3)
  Top 0.4: v18,43.6 18,35.6 11.2,28.8 v11.2,23.5
  Bottom 0.4: SW.C1.2-DOUT 18.15,43.45 v18,43.6 | v11.2,23.5 11.35,23.65 SW.D1.4-DIN
N$44  (via drill 0.4)
  Top 0.4: U.B0.2-DOUT 2.55,49.85 v2.7,49.7
  Bottom 0.4: v2.7,49.7 3.3,49.1 R12.2
N$46  (via drill 0.3)
  Top 0.4: v58,39.6 59,38.6 59,31.6 54,26.6 54,24.6 56,22.6 v56,16.5
  Bottom 0.4: SW.D3.2-DOUT 58.65,38.95 v58,39.6 | v56,16.5 56.35,16.15 SW.E3.4-DIN
N$47  (via drill 0.3)
  Top 0.4: v58,56.6 59,55.6 59,48.6 52,41.6 v52,36.4
  Bottom 0.4: SW.C3.2-DOUT 58.65,55.95 v58,56.6 | v52,36.4 52.35,36.05 SW.D3.4-DIN
N$48  (via drill 0.3)
  Top 0.4: v58,73.4 59,72.4 59,65.6 52,58.6 v52,53.5
  Bottom 0.4: SW.B3.2-DOUT 58.65,72.75 v58,73.4 | v52,53.5 52.35,53.15 SW.C3.4-DIN
N$49  (via drill 0.3)
  Top 0.4: v59,90.6 59,82.6 52.2,75.8 52.2,70.8 v51.9,70.5
  Bottom 0.4: SW.A3.2-DOUT 58.65,90.25 v59,90.6 | v51.9,70.5 52.25,70.15 SW.B3.4-DIN
N$50  (via drill 0.3)
  Top 0.4: U.^3.2-DOUT 54.25,94.35 v54,94.1 | v52,90.6 v52,87.5
  Bottom 0.4: v54,94.1 52,92.1 v52,90.6 | v52,87.5 52.35,87.15 SW.A3.4-DIN
N$51  (via drill 0.3)
  Top 0.4: v26,14.1 25.3,14.1 23.55,12.35 U.F2.4-DIN
  Bottom 0.4: SW.E3.2-DOUT 62.65,18.95 62,19.6 48,19.6 45,16.6 42,16.6 40.8,15.4 34.8,15.4 33.3,13.9 26.2,13.9 v26,14.1
N$52  (via drill 0.3)
  Top 0.4: U.D0.2-DOUT 2.55,16.55 v2.6,16.5 | v6,55.6 5.15,56.45 U.B0.4-DIN
  Bottom 0.4: v2.6,16.5 3.7,17.6 5,17.6 6,18.6 6,22.6 4,24.6 4,42.6 5.2,43.8 5.2,50.7 5.9,51.4 5.9,55.1 6,55.2 v6,55.6
N$53  (via drill 0.3)
  Top 0.4: v69.9,58.4 71,57.3 71,48.6 v75,44.6
  Bottom 0.4: SW.C4.4-DIN 70.25,58.05 v69.9,58.4 | v75,44.6 76,44.6 77,43.6 77,42.9 SW.D4.2-DOUT
N$54  (via drill 0.3)
  Top 0.4: v75,61.6 71,65.6 71,74.3 v69.9,75.4
  Bottom 0.4: SW.C4.2-DOUT 76.65,60.95 76,61.6 v75,61.6 | v69.9,75.4 70.25,75.05 SW.B4.4-DIN
N$55  (via drill 0.3)
  Top 0.4: v75,78.6 71,82.6 71,91.4 v70,92.4
  Bottom 0.4: SW.B4.2-DOUT 76.65,77.95 76,78.6 v75,78.6 | v70,92.4 70.35,92.05 SW.A4.4-DIN
N$56  (via drill 0.3)
  Top 0.4: v39,27.6 35,31.6 35,39.6 v34,40.6
  Bottom 0.4: SW.D2.2-DOUT 40.65,26.95 40,27.6 v39,27.6 | v34,40.6 34.05,40.65 SW.C2.4-DIN
N$64  (via drill 0.3)
  Top 0.4: v63,94.6 61.25,92.85 U.^3.4-DIN
  Bottom 0.4: SW.A4.2-DOUT 76.65,94.95 76,95.6 64,95.6 v63,94.6
N$73  (via drill 0.3)
  Top 0.4: v81,19.6 81,20.1 71,30.1 71,40.3 v69.9,41.4
  Bottom 0.4: SW.E4.2-DOUT 80.65,19.25 v81,19.6 | v69.9,41.4 70.25,41.05 SW.D4.4-DIN
N$74  (via drill 0.3)
  Top 0.4: v34,23.6 35,22.6 35,14.4 37,12.4 37,10.6 35.7,9.3 31.1,9.3 30.55,9.85 U.F2.2-DOUT
  Bottom 0.4: SW.D2.4-DIN 34.05,23.65 v34,23.6
N$89  (via drill 0.3)
  Top 0.4: v73.9,16.5 74.1,16.3 74.1,10.5 76,8.6 v76,7.6 | v79,2.6 78.75,2.35 U.F4.2-DOUT
  Bottom 0.4: SW.E4.4-DIN 74.25,16.15 v73.9,16.5 | v79,2.6 79,3.3 76,6.3 v76,7.6
POWER+  (via drill 0.5)
  Top 0.6: HDD_LED.6 35,88.7 36.3,90 36.3,92 35,93.3 PWR_LED.6 | JFP1.6 16,88.7 v18.3,91
  Bottom 0.6: v18.3,91 19.9,92.6 34,92.6 35,93.6 PWR_LED.6
POWER-
  Top 0.6: HDD_LED.8 37.54,88.64 38.8,89.9 38.8,92 37.54,93.26 PWR_LED.8
  Bottom 0.6: JFP1.8 19.97,89.3 22.3,89.3 25,86.6 36.27,86.6 HDD_LED.8
PWR_B1
  Top 0.6: J_PWR.3 29.67,91.08 PWR_LED.1
PWR_B2
  Top 0.6: J_PWR.1 29.67,94.12 PWR_LED.2
PWR_LED+
  Top 0.6: JFP1.2 10.92,88.37 16.15,93.6 21.5,93.6 22.5,92.6 J_PWR.2
PWR_LED-
  Top 0.6: PWR_LED.3 PWR_LED.4
  Bottom 0.6: JFP1.4 21.19,95.6 31,95.6 32.46,94.14 PWR_LED.4
R.A  (via drill 0.3)
  Top 0.4: v23,50.6 24.1,51.7 24.1,57.5 v15,66.6
  Bottom 0.3: J1.4 23.95,46.85 23,47.8
  Bottom 0.4: D.A4.2 74.23,84.8 73.23,85.8 67.2,85.8 67,85.6 67,83.6 64,80.6 58.53,80.6 D.A3.2 57.73,79.87 56.7,80.9 48.3,80.9 47,79.6 47,70.6 45,68.6 41.03,68.6 D.A2.2 38.73,68.3 13.73,68.3 D.A1.2 14.3,67.3 v15,66.6 | 23,47.8 v23,50.6
R.B
  Bottom 0.3: J1.5 23.35,46.35 19.2,50.5
  Bottom 0.4: D.B4.2 74.23,67.8 73.23,68.8 67.2,68.8 67,68.6 67,66.6 64,63.6 58.53,63.6 D.B3.2 56.73,63.8 48.2,63.8 45.8,61.4 45.8,52.4 45,51.6 41.03,51.6 D.B2.2 38.23,50.3 36.83,51.7 18.63,51.7 D.B1.2 17.43,50.5 19.2,50.5
R.C  (via drill 0.3)
  Top 0.4: v21.9,46.6 19.9,48.6 18.1,48.6 v17.9,48.8
  Bottom 0.3: J1.6 22.65,45.85 v21.9,46.6
  Bottom 0.4: D.C1.2 18.53,34.6 23,34.6 | D.C4.2 74.53,50.8 73.53,51.8 67.2,51.8 67,51.6 67,49.6 64,46.6 58.53,46.6 D.C3.2 56.73,46.8 48.2,46.8 48,46.6 48,37.6 45,34.6 41,34.6 41,34.57 D.C2.2 38.3,33.3 37,34.6 23,34.6 | v17.9,48.8 17.9,45.7 20,43.6 20.7,43.6 23,41.3 23,34.6
R.D  (via drill 0.3)
  Top 0.4: v20.1,45.8 20.1,45 23,42.1 v23,17.6
  Bottom 0.3: J1.7 20.55,45.35 v20.1,45.8
  Bottom 0.4: D.D1.2 18.53,17.6 v23,17.6 37,17.6 38.3,16.3 D.D2.2 41.03,17.6 45,17.6 47.3,19.9 47.3,28.9 48.1,29.7 56.9,29.7 57.73,28.87 D.D3.2 58.53,29.6 64,29.6 67,32.6 67,34.6 67.2,34.8 73.3,34.8 74.3,33.8 D.D4.2
R.E  (via drill 0.3)
  Top 0.4: v60,9.6 59.7,9.9 52.7,9.9 46.1,16.5 46.1,24.5 v46,24.6 | v45.8,33.6 45.8,33.7 45.9,33.8 45.9,59.3 38.6,66.6 v38,66.6 | v27,62.6 27,52.6 24,49.6 v18.9,49.6
  Bottom 0.3: J1.8 19.75,44.85
  Bottom 0.4: D.E4.2 78.23,8.9 77.03,10.1 62.93,10.1 D.E3.2 60.7,8.9 v60,9.6 | v45.8,33.6 45.8,24.8 v46,24.6 | v38,66.6 37.5,66.6 36.4,65.5 27.9,65.5 27,64.6 v27,62.6 | v18.9,49.6 18.9,45.7 19.75,44.85
RESERVED
  Top 0.6: PWR_LED.9 40.08,89.83 38.8,88.55 38.8,86.61 HDD_LED.9 40.08,84.68 39,83.6 22.81,83.6 JFP1.9
RESET+
  Top 0.6: HDD_LED.5 33.7,86.63 33.7,88.7 | 33.7,88.7 35,90 PWR_LED.5 | JFP1.5 17.3,86.63 17.3,88.6 18.3,89.6 32.8,89.6 33.7,88.7
RESET-  (via drill 0.5)
  Top 0.6: HDD_LED.7 36.3,86.57 36.3,88.7 37.54,89.94 PWR_LED.7 | JFP1.7 18.54,85.14 17,83.6 10,83.6 9.5,84.1 9.5,88.5 v10.6,89.6 | v22.2,91.3 20.9,92.6 16.7,92.6 v15.6,91.5
  Bottom 0.6: v22.2,91.3 23.9,89.6 36,89.6 37.54,91.14 PWR_LED.7 | v15.6,91.5 13.7,89.6 v10.6,89.6

### Text on the board
tPlace: +PWR- | PWR | +HDD- | RESET | ~ | Li | Anders Voss / V0.3.1 / 04/24/22 | Lithium
bPlace: Anders Voss / V0.3.1 / 04/24/22